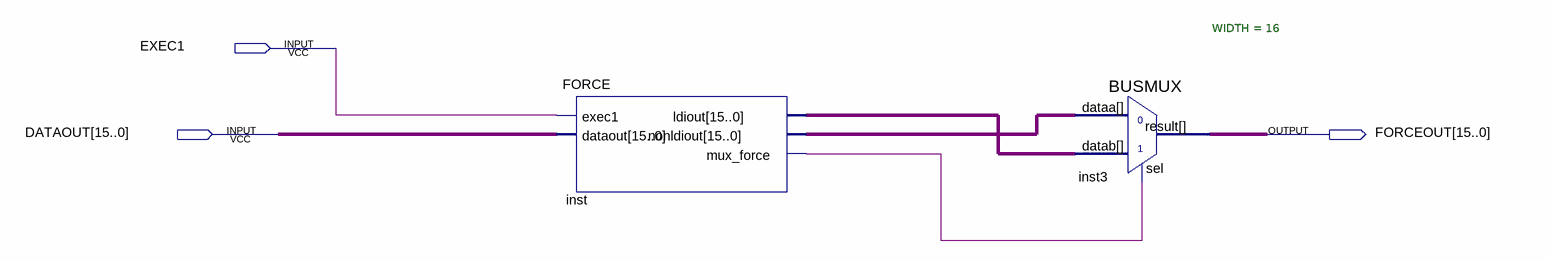
[diagram p0: schematic sheet]
// Quartus schematic FORCE_BDF.bdf as structural Verilog: 2 symbols, 3 pins
module FORCE_BDF (
  input  EXEC1,
  input  [15:0] DATAOUT,
  output [15:0] FORCEOUT
);

  wire inst_mux_force;
  wire [15:0] inst_ldiout, inst_nonldiout;

  FORCE inst (
    .exec1(EXEC1), .dataout(DATAOUT), .ldiout(inst_ldiout), .nonldiout(inst_nonldiout),
    .mux_force(inst_mux_force));
  BUSMUX #(.WIDTH(16)) inst3 (.datab(inst_ldiout), .sel(inst_mux_force), .dataa(inst_nonldiout), .result(FORCEOUT));
endmodule
